# Altium schematic sheet DAC_CPU.SchDoc: DAC CPU Board
size Tabloid; Date: 06/07/2023; Engineer: Terry D. Schevker; Revision: 1.0; SheetNumber: 2; SheetTotal: 3
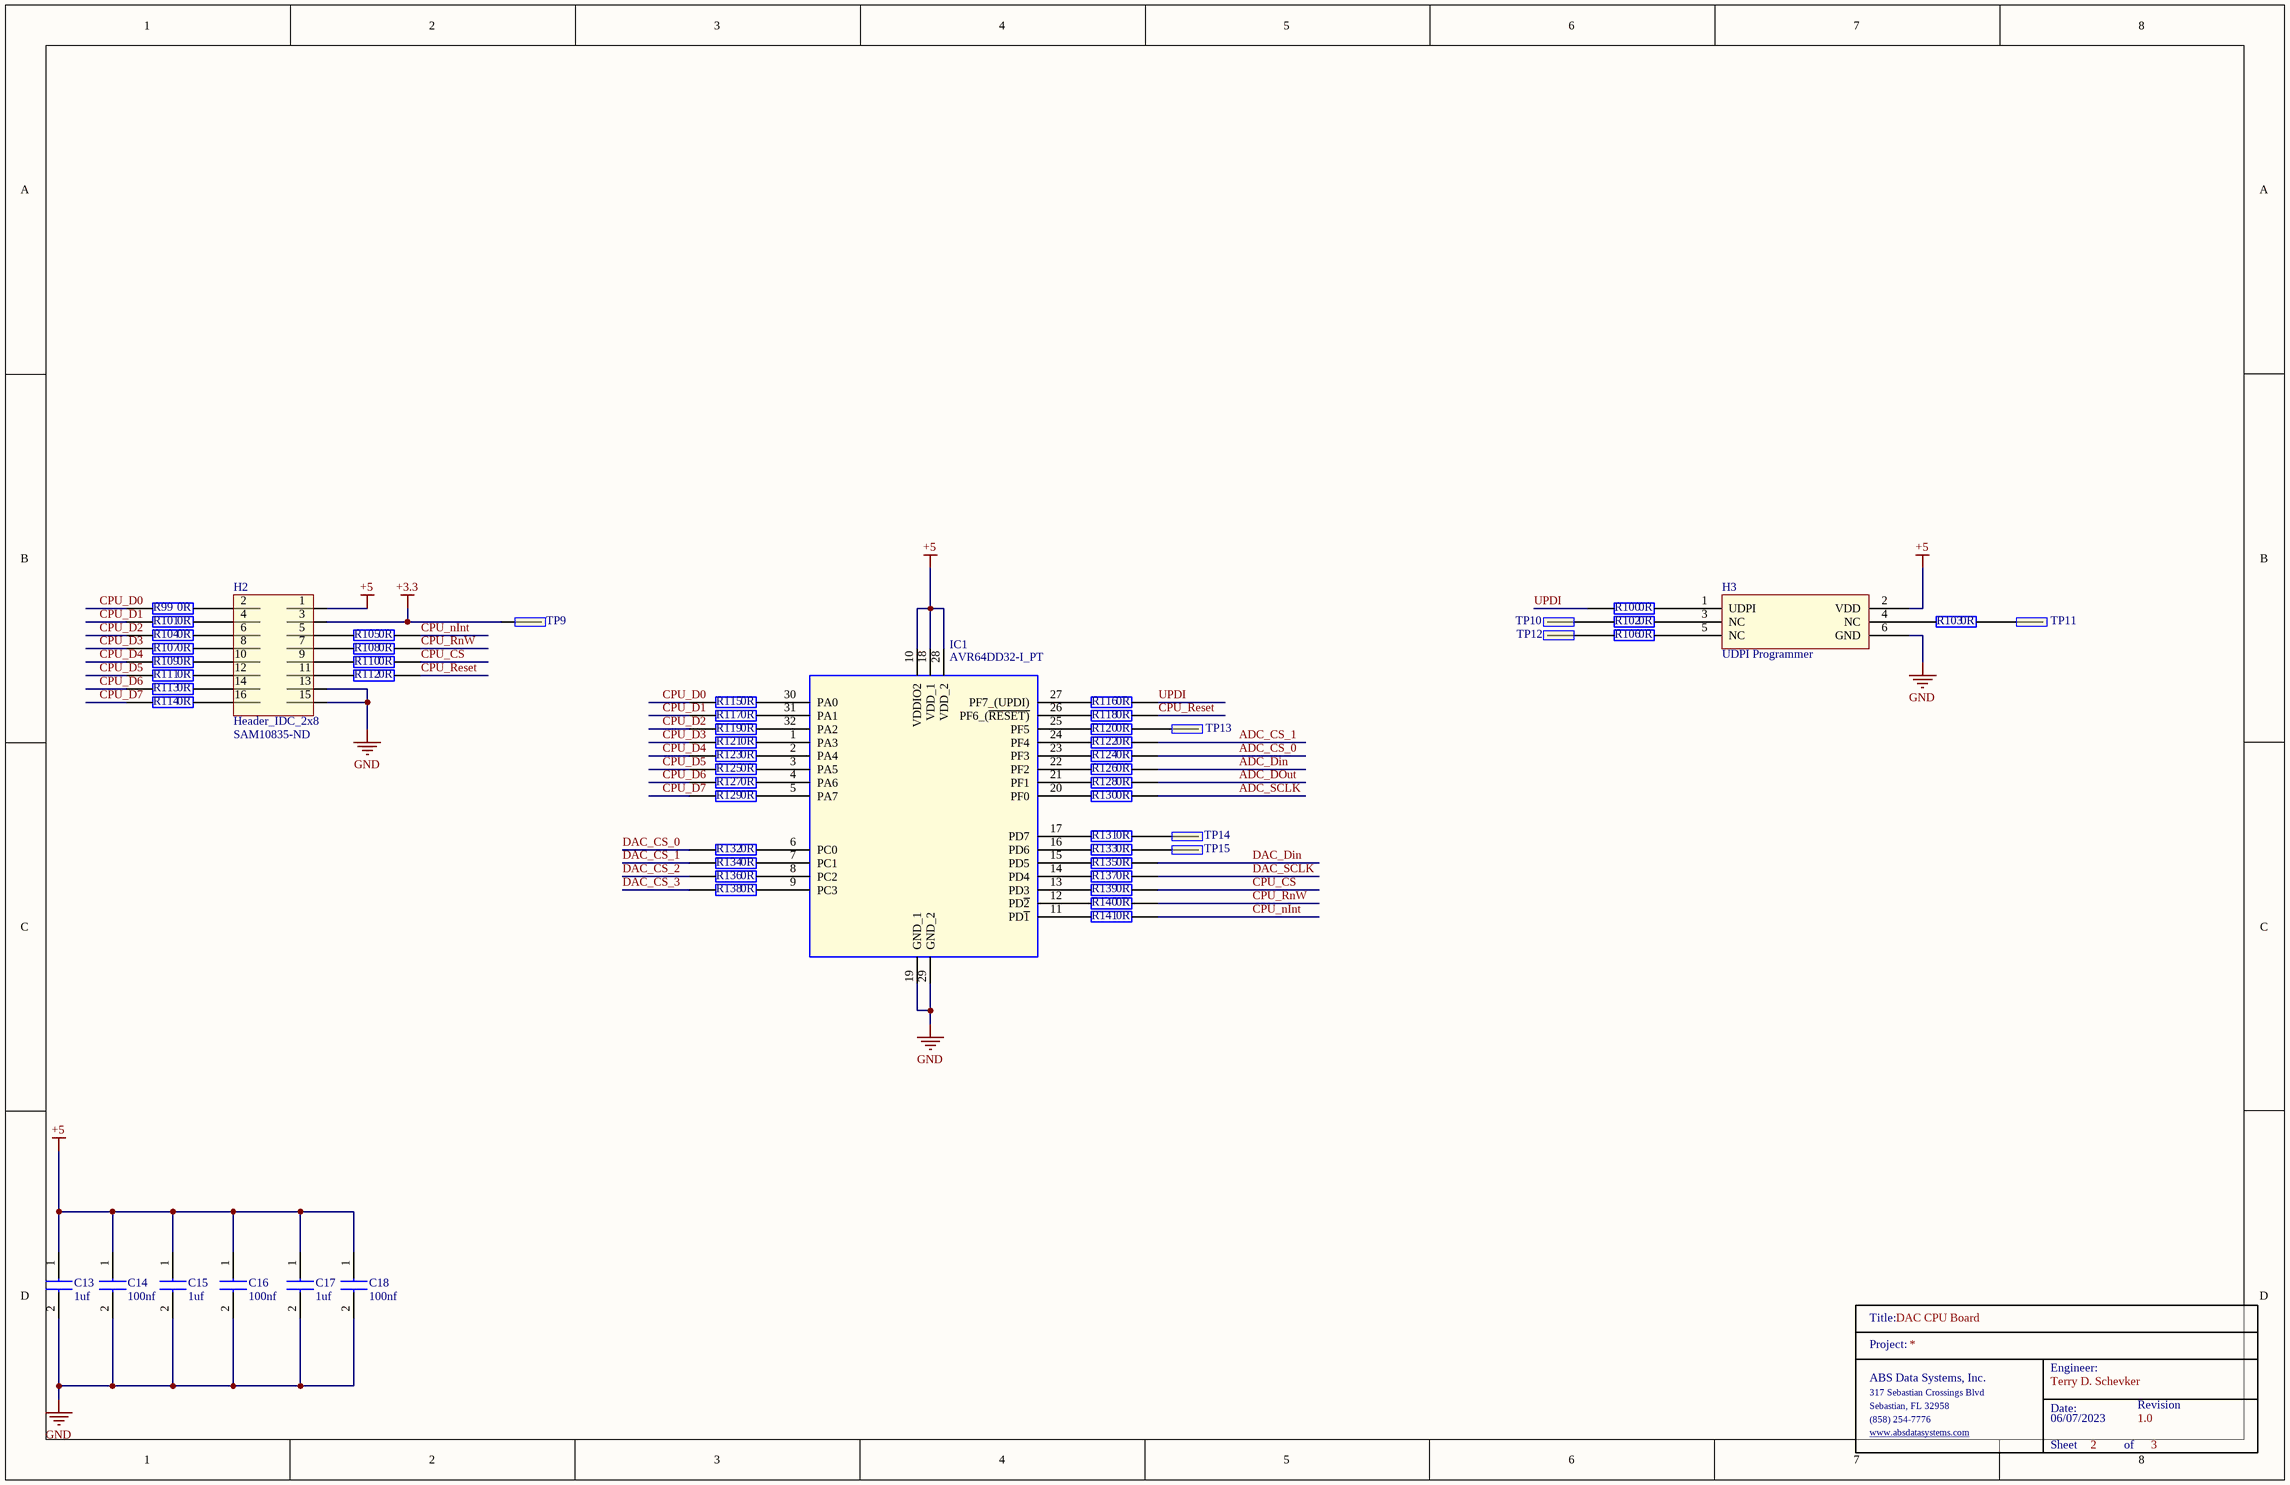
[diagram p0: DAC_CPU.SchDoc]

## Parts
C13  1uf  [0603]
C14  100nf  [0603]
C15  1uf  [0603]
C16  100nf  [0603]
C17  1uf  [0603]
C18  100nf  [0603]
H2  Header_IDC_2x8  Supplier Part Number 1: SAM10835-ND  [HEADER16]
H3  UDPI Programmer  [HDR2X3]
IC1  AVR64DD32-I_PT  [QFP80P900X900X120-32N]
R99  0R  [0603]
R100  0R  [0603]
R101  0R  [0603]
R102  0R  [0603]
R103  0R  [0603]
R104  0R  [0603]
R105  0R  [0603]
R106  0R  [0603]
R107  0R  [0603]
R108  0R  [0603]
R109  0R  [0603]
R110  0R  [0603]
R111  0R  [0603]
R112  0R  [0603]
R113  0R  [0603]
R114  0R  [0603]
R115  0R  [0603]
R116  0R  [0603]
R117  0R  [0603]
R118  0R  [0603]
R119  0R  [0603]
R120  0R  [0603]
R121  0R  [0603]
R122  0R  [0603]
R123  0R  [0603]
R124  0R  [0603]
R125  0R  [0603]
R126  0R  [0603]
R127  0R  [0603]
R128  0R  [0603]
R129  0R  [0603]
R130  0R  [0603]
R131  0R  [0603]
R132  0R  [0603]
R133  0R  [0603]
R134  0R  [0603]
R135  0R  [0603]
R136  0R  [0603]
R137  0R  [0603]
R138  0R  [0603]
R139  0R  [0603]
R140  0R  [0603]
R141  0R  [0603]
TitleBlock_?  TitleBlock  (value not drawn)  (graphical)
TP9  TP  [TP]  (value not drawn)
TP10  TP  [TP]  (value not drawn)
TP11  TP  [TP]  (value not drawn)
TP12  TP  [TP]  (value not drawn)
TP13  TP  [TP]  (value not drawn)
TP14  TP  [TP]  (value not drawn)
TP15  TP  [TP]  (value not drawn)

## Nets
+3.3: H2.3 TP9.1
+5: C13.1 C14.1 C15.1 C16.1 C17.1 C18.1 H2.1 H3.2(VDD) IC1.10(VDDIO2) IC1.18(VDD_1) IC1.28(VDD_2)
GND: C13.2 C14.2 C15.2 C16.2 C17.2 C18.2 H2.13 H2.15 H3.6(GND) IC1.19(GND_1) IC1.29(GND_2)
ADC_CS_0: R124.2
ADC_CS_1: R122.2
ADC_Din: R126.2
ADC_DOut: R128.2
ADC_SCLK: R130.2
CPU_CS: R110.2 R139.2
CPU_D0: R99.1 R115.1
CPU_D1: R101.1 R117.1
CPU_D2: R104.1 R119.1
CPU_D3: R107.1 R121.1
CPU_D4: R109.1 R123.1
CPU_D5: R111.1 R125.1
CPU_D6: R113.1 R127.1
CPU_D7: R114.1 R129.1
CPU_nInt: R105.2 R141.2
CPU_Reset: R112.2 R118.2
CPU_RnW: R108.2 R140.2
DAC_CS_0: R132.1
DAC_CS_1: R134.1
DAC_CS_2: R136.1
DAC_CS_3: R138.1
DAC_Din: R135.2
DAC_SCLK: R137.2
UPDI: R100.1 R116.2
NetH2_2: H2.2 R99.2
NetH2_4: H2.4 R101.2
NetH2_5: H2.5 R105.1
NetH2_6: H2.6 R104.2
NetH2_7: H2.7 R108.1
NetH2_8: H2.8 R107.2
NetH2_9: H2.9 R110.1
NetH2_10: H2.10 R109.2
NetH2_11: H2.11 R112.1
NetH2_12: H2.12 R111.2
NetH2_14: H2.14 R113.2
NetH2_16: H2.16 R114.2
NetH3_1: H3.1(UDPI) R100.2
NetH3_3: H3.3(NC) R102.2
NetH3_4: H3.4(NC) R103.1
NetH3_5: H3.5(NC) R106.2
NetIC1_1: IC1.1(PA3) R121.2
NetIC1_2: IC1.2(PA4) R123.2
NetIC1_3: IC1.3(PA5) R125.2
NetIC1_4: IC1.4(PA6) R127.2
NetIC1_5: IC1.5(PA7) R129.2
NetIC1_6: IC1.6(PC0) R132.2
NetIC1_7: IC1.7(PC1) R134.2
NetIC1_8: IC1.8(PC2) R136.2
NetIC1_9: IC1.9(PC3) R138.2
NetIC1_11: IC1.11(PD~{1}) R141.1
NetIC1_12: IC1.12(PD~{2}) R140.1
NetIC1_13: IC1.13(PD3) R139.1
NetIC1_14: IC1.14(PD4) R137.1
NetIC1_15: IC1.15(PD5) R135.1
NetIC1_16: IC1.16(PD6) R133.1
NetIC1_17: IC1.17(PD7) R131.1
NetIC1_20: IC1.20(PF0) R130.1
NetIC1_21: IC1.21(PF1) R128.1
NetIC1_22: IC1.22(PF2) R126.1
NetIC1_23: IC1.23(PF3) R124.1
NetIC1_24: IC1.24(PF4) R122.1
NetIC1_25: IC1.25(PF5) R120.1
NetIC1_26: IC1.26(PF6_(~{RESET)}) R118.1
NetIC1_27: IC1.27(PF7_(UPDI)) R116.1
NetIC1_30: IC1.30(PA0) R115.2
NetIC1_31: IC1.31(PA1) R117.2
NetIC1_32: IC1.32(PA2) R119.2
NetR102_1: R102.1 TP10.1
NetR103_2: R103.2 TP11.1
NetR106_1: R106.1 TP12.1
NetR120_2: R120.2 TP13.1
NetR131_2: R131.2 TP14.1
NetR133_2: R133.2 TP15.1

## Notes on the sheet
- (in symbol TitleBlock) Title:; Project:; Engineer:; ABS Data Systems, Inc.; 317 Sebastian Crossings Blvd; Sebastian, FL 32958; Date:; Revision; (858) 254-7776; www.absdatasystems.com; Sheet; of

## Library data of the parts
C13 C15 C17 = CL10B105KA8NNNL: Samsung Electro-Mechanics 0603 1uf
C14 C16 C18 = CL10B104JB8NNNC: Samsung Electro-Mechanics 0603 100nf
H2 = Header_IDC_2x8: 16 Pin 2x8 Through Hold IDC Connector; Manufacturer: Samtec; Manufacturer Part Number: TST-108-01-G-D; Number of Contacts: 16; Gender: Male; Connector Type: Male Pin; Pitch: 2.54mm; Row Spacing: 0.1inch; Supplier 1: Digi-Key; RoHS: Yes; Category: Headers and Wire Housings; Stock 1: 227; Pricing 1: 1=2.85000, 10=2.73600, 100=2.28000, 500=1.93800, 1000=1.65300, 5000=1.48200 (USD); Mount: Through Hole; Contact Plating: Gold; Contact Material: Bronze; Housing Material: Polyester; Housing Color: Black; Color: Black; Min Operating Temperature: -55°C; Max Operating Temperature: 125°C; Number of Rows: 2; Termination: Solder; Packaging: Rail/Tube; Orientation: Straight; Number of Positions: 16; Length: 27.94mm; Depth: 9.27mm; Contact Mating Length: 0.25inch; REACH SVHC: No SVHC; ComponentLink1URL: https://datasheet.ciiva.com/739/tst-mkt-739845.pdf?src-supplier=Digi-Key; ComponentLink1Description: https://datasheet.ciiva.com/739/tst-mkt-739845.pdf?src-supplier=Digi-Key; ComponentLink2URL: https://datasheet.ciiva.com/10018/htst-10018510.pdf?src-supplier=Avnet; ComponentLink2Description: https://datasheet.ciiva.com/10018/htst-10018510.pdf?src-supplier=Avnet
H3 = UDPI Programmer: 6 Pin 2X3 Through Hole Header
IC1 = AVR64DD32-I_PT: Integrated Circuit; Manufacturer_Name: Microchip; Manufacturer_Part_Number: AVR64DD32-I/PT | MULTI-VOLTAGE I/O; Datasheet Link: https://www.microchip.com/en-us/product/AVR64DD32; Height: 1.2mm
R99-R141 = RC0603JR-070RL: YAGEO 0603 0 ohm; Manufacturer_Name: KEMET; Geometry.Height: 0.55mm; Mouser Part Number: 603-RC0603JR-070RL; Mouser Price/Stock: https://www.mouser.co.uk/ProductDetail/YAGEO/RC0603JR-070RL?qs=2cAdsCoAWRGWyPcuXgGiXQ%3D%3D; Manufacturer_Part_Number: RC0603JR-070RL; Datasheet Link: https://datasheet.datasheetarchive.com/originals/distributors/Datasheets_SAMA/902f9e387b938f871d31120f5fc1d65e.pdf
TP9-TP15 = TP: Manufacturer: Samtec; Manufacturer Part Number: TST-105-01-G-D; Number of Contacts: 16; Gender: Male; Connector Type: Male Pin; Pitch: 2.54mm; Row Spacing: 0.1inch; Supplier 1: Digi-Key; RoHS: Yes; Category: Headers and Wire Housings; Stock 1: 227; Pricing 1: 1=2.85000, 10=2.73600, 100=2.28000, 500=1.93800, 1000=1.65300, 5000=1.48200 (USD); Mount: Through Hole; Contact Plating: Gold; Contact Material: Bronze; Housing Material: Polyester; Housing Color: Black; Color: Black; Min Operating Temperature: -55°C; Max Operating Temperature: 125°C; Number of Rows: 2; Termination: Solder; Packaging: Rail/Tube; Orientation: Straight; Number of Positions: 16; Length: 27.94mm; Depth: 9.27mm; Contact Mating Length: 0.25inch; REACH SVHC: No SVHC; ComponentLink1URL: https://datasheet.ciiva.com/739/tst-mkt-739845.pdf?src-supplier=Digi-Key; ComponentLink1Description: https://datasheet.ciiva.com/739/tst-mkt-739845.pdf?src-supplier=Digi-Key; ComponentLink2URL: https://datasheet.ciiva.com/10018/htst-10018510.pdf?src-supplier=Avnet; ComponentLink2Description: https://datasheet.ciiva.com/10018/htst-10018510.pdf?src-supplier=Avnet